# Altium schematic sheet pwrconv.SchDoc
size 297 x 209 mm
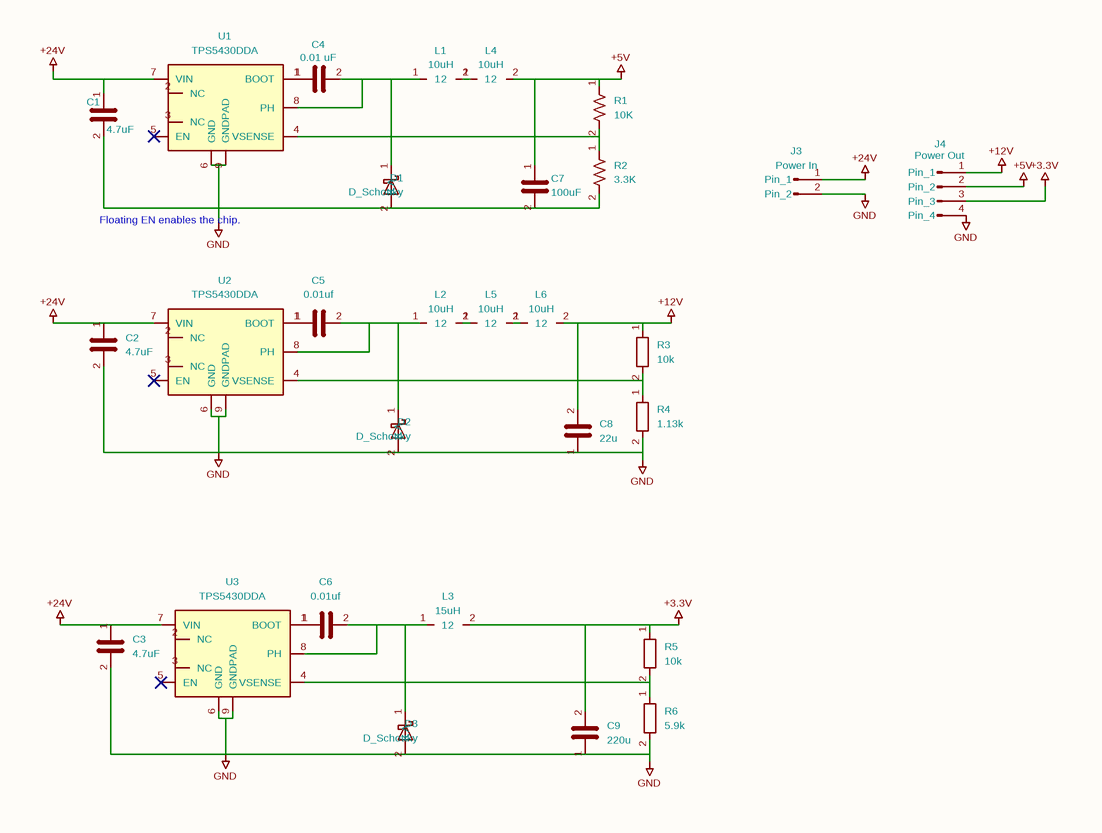
[diagram p0: pwrconv.SchDoc]

## Parts
C1  4.7uF  [C_0805_2012Metric]
C2  4.7uF  [C_0805_2012Metric]
C3  4.7uF  [C_0805_2012Metric]
C4  0.01 uF  [C_0603_1608Metric]
C5  0.01uf  [C_0603_1608Metric]
C6  0.01uf  [C_0603_1608Metric]
C7  100uF  [C_Elec_6.3x7.7]
C8  22u  [C_0805_2012Metric]
C9  220u  [C_0805_2012Metric]
D1  D_Schottky  [D_SOD-323]
D2  D_Schottky  [D_SOD-323]
D3  D_Schottky  [D_SOD-323]
J3  Power In  [PinHeader_1x02_P2.54mm_Vertical]
J4  Power Out  [PinHeader_1x04_P2.54mm_Vertical]
L1  10uH  [L_Changjiang_FXL0630]
L2  10uH  [L_Changjiang_FXL0630]
L3  15uH  [L_Changjiang_FXL0630]
L4  10uH  [L_Changjiang_FXL0630]
L5  10uH  [L_Changjiang_FXL0630]
L6  10uH  [L_Changjiang_FXL0630]
R1  10K  [R_0603_1608Metric]
R2  3.3K  [R_1206_3216Metric]
R3  10k  [R_0603_1608Metric]
R4  1.13k  [R_1206_3216Metric]
R5  10k  [R_0603_1608Metric]
R6  5.9k  [R_1206_3216Metric]
U1  TPS5430DDA  [TI_SO-PowerPAD-8_ThermalVias]
U2  TPS5430DDA  [TI_SO-PowerPAD-8_ThermalVias]
U3  TPS5430DDA  [TI_SO-PowerPAD-8_ThermalVias]

## Nets
+3.3V: C9.2 J4.3(Pin_3) L3.2 R5.1
+5V: C7.1 J4.2(Pin_2) L4.2 R1.1
+12V: C8.2 J4.1(Pin_1) L6.2 R3.1
+24V: C1.1 C2.1 C3.1 J3.1(Pin_1) U1.7(VIN) U2.7(VIN) U3.7(VIN)
GND: C1.2 C2.2 C3.2 C7.2 C8.1 C9.1 D1.2(A) D2.2(A) D3.2(A) J3.2(Pin_2) J4.4(Pin_4) R2.2 R4.2 R6.2 U1.6(GND) U1.9(GNDPAD) U2.6(GND) U2.9(GNDPAD) U3.6(GND) U3.9(GNDPAD)
NetC4_1: C4.1 U1.1(BOOT)
NetC4_2: C4.2 D1.1(K) L1.1 U1.8(PH)
NetC5_1: C5.1 U2.1(BOOT)
NetC5_2: C5.2 D2.1(K) L2.1 U2.8(PH)
NetC6_1: C6.1 U3.1(BOOT)
NetC6_2: C6.2 D3.1(K) L3.1 U3.8(PH)
NetL1_2: L1.2 L4.1
NetL2_2: L2.2 L5.1
NetL5_2: L5.2 L6.1
NetR1_2: R1.2 R2.1 U1.4(VSENSE)
NetR3_2: R3.2 R4.1 U2.4(VSENSE)
NetR5_2: R5.2 R6.1 U3.4(VSENSE)

Not connected (* = marked no-connect by the designer): U1 2(NC) 3(NC) 5(EN)*; U2 2(NC) 3(NC) 5(EN)*; U3 2(NC) 3(NC) 5(EN)*

## Notes on the sheet
- Floating EN enables the chip.
- 1
- 2
- 3
- 4
- 5
- 6
- A
- B
- C
- Tracy, Maria, Phina, David
- D
- Title:
- File: pwrconv.kicad_sch
- Sheet: /
- UW Huskysat
- KiCad E.D.A.  kicad (5.1.4)-1
- Size: A4
- Date: 2024-11-14
- Rev:
- Id: 1/1

## Library data of the parts
C1 C4 C7 = C: Description: Unpolarized capacitor
  C1: LCSC: C1779; Value: 4.7uF; Footprint: Capacitor_SMD:C_0805_2012Metric
  C4: LCSC: C1589; Value: 0.01 uF; Footprint: Capacitor_SMD:C_0603_1608Metric
  C7: LCSC: C2836437; Value: 100uF; Footprint: Capacitor_SMD:C_Elec_6.3x7.7
C2 C3 = C: Description: Unpolarized Capacitor; LCSC: C1779; Value: 4.7uF; Footprint: Capacitor_SMD:C_0805_2012Metric
C5 C6 C8 C9 = C
  C5 C6: LCSC: C1589; Value: 0.01uf; Footprint: Capacitor_SMD:C_0603_1608Metric
  C8: LCSC: C45783; Value: 22u; Footprint: Capacitor_SMD:C_0805_2012Metric
  C9: LCSC: C125977; Value: 220u; Footprint: Capacitor_SMD:C_0805_2012Metric
D1-D3 = D_Schottky: Description: Schottky diode; LCSC: C191023; Value: D_Schottky; Footprint: Diode_SMD:D_SOD-323
J3 = Conn_01x02_Pin: Description: Generic connector, single row, 01x02, script generated; Value: Power In; Footprint: Connector_PinHeader_2.54mm:PinHeader_1x02_P2.54mm_Vertical
J4 = Conn_01x04_Pin: Description: Generic connector, single row, 01x04, script generated; Value: Power Out; Footprint: Connector_PinHeader_2.54mm:PinHeader_1x04_P2.54mm_Vertical
L1-L6 = L: Footprint: Inductor_SMD:L_Changjiang_FXL0630
  L1 L2 L4-L6: LCSC: C167223; Value: 10uH
  L3: LCSC: C40000; Value: 15uH
R1 R2 = R_US: Description: Resistor, US symbol
  R1: LCSC: C15401; Value: 10K; Footprint: Resistor_SMD:R_0603_1608Metric
  R2: LCSC: C26041; Value: 3.3K; Footprint: Resistor_SMD:R_1206_3216Metric
R3-R6 = R
  R3 R5: LCSC: C15401; Value: 10k; Footprint: Resistor_SMD:R_0603_1608Metric
  R4: LCSC: C4410; Value: 1.13k; Footprint: Resistor_SMD:R_1206_3216Metric
  R6: LCSC: C488883; Value: 5.9k; Footprint: Resistor_SMD:R_1206_3216Metric
U1 = TPS5430DDA: Description: 3A, Step Down Swift Converter, Adjustable Output Voltage, 5.5-36V Input Voltage, PowerSO-8; LCSC: C9864; Value: TPS5430DDA; Footprint: Package_SO:TI_SO-PowerPAD-8_ThermalVias
U2 U3 = TPS5430DDA: LCSC: C9864; Value: TPS5430DDA; Footprint: Package_SO:TI_SO-PowerPAD-8_ThermalVias